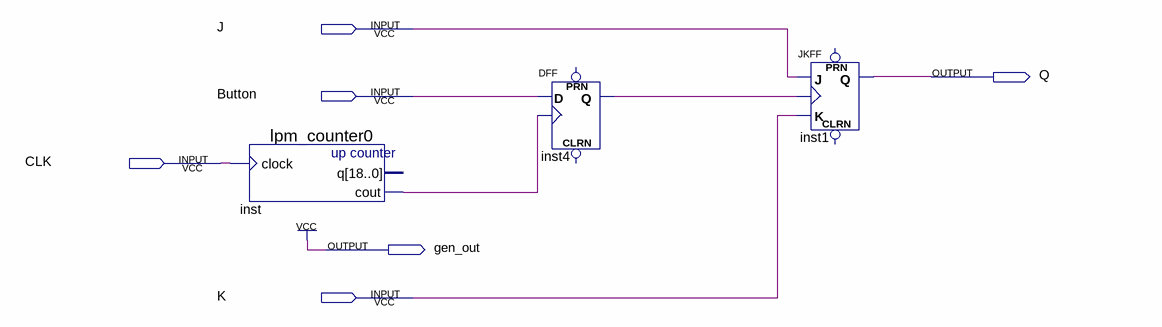
[diagram p0: schematic sheet]
// Quartus schematic lab4-3.bdf as structural Verilog: 3 symbols, 6 pins
module \lab4-3  (
  input  J,
  input  Button,
  input  CLK,
  input  K,
  output Q,
  output gen_out
);

  wire inst4_q, inst_cout;

  lpm_counter0 inst (.clock(CLK), .cout(inst_cout));  // open: q
  DFF inst4 (.CLK(inst_cout), .D(Button), .Q(inst4_q));  // open: CLRN, PRN
  JKFF inst1 (.K(K), .J(J), .CLK(inst4_q), .Q(Q));  // open: PRN, CLRN

  assign gen_out = 1'b1;
endmodule
